# Altium schematic sheet FlexEMG_v0r0_NM.SchDoc
size B
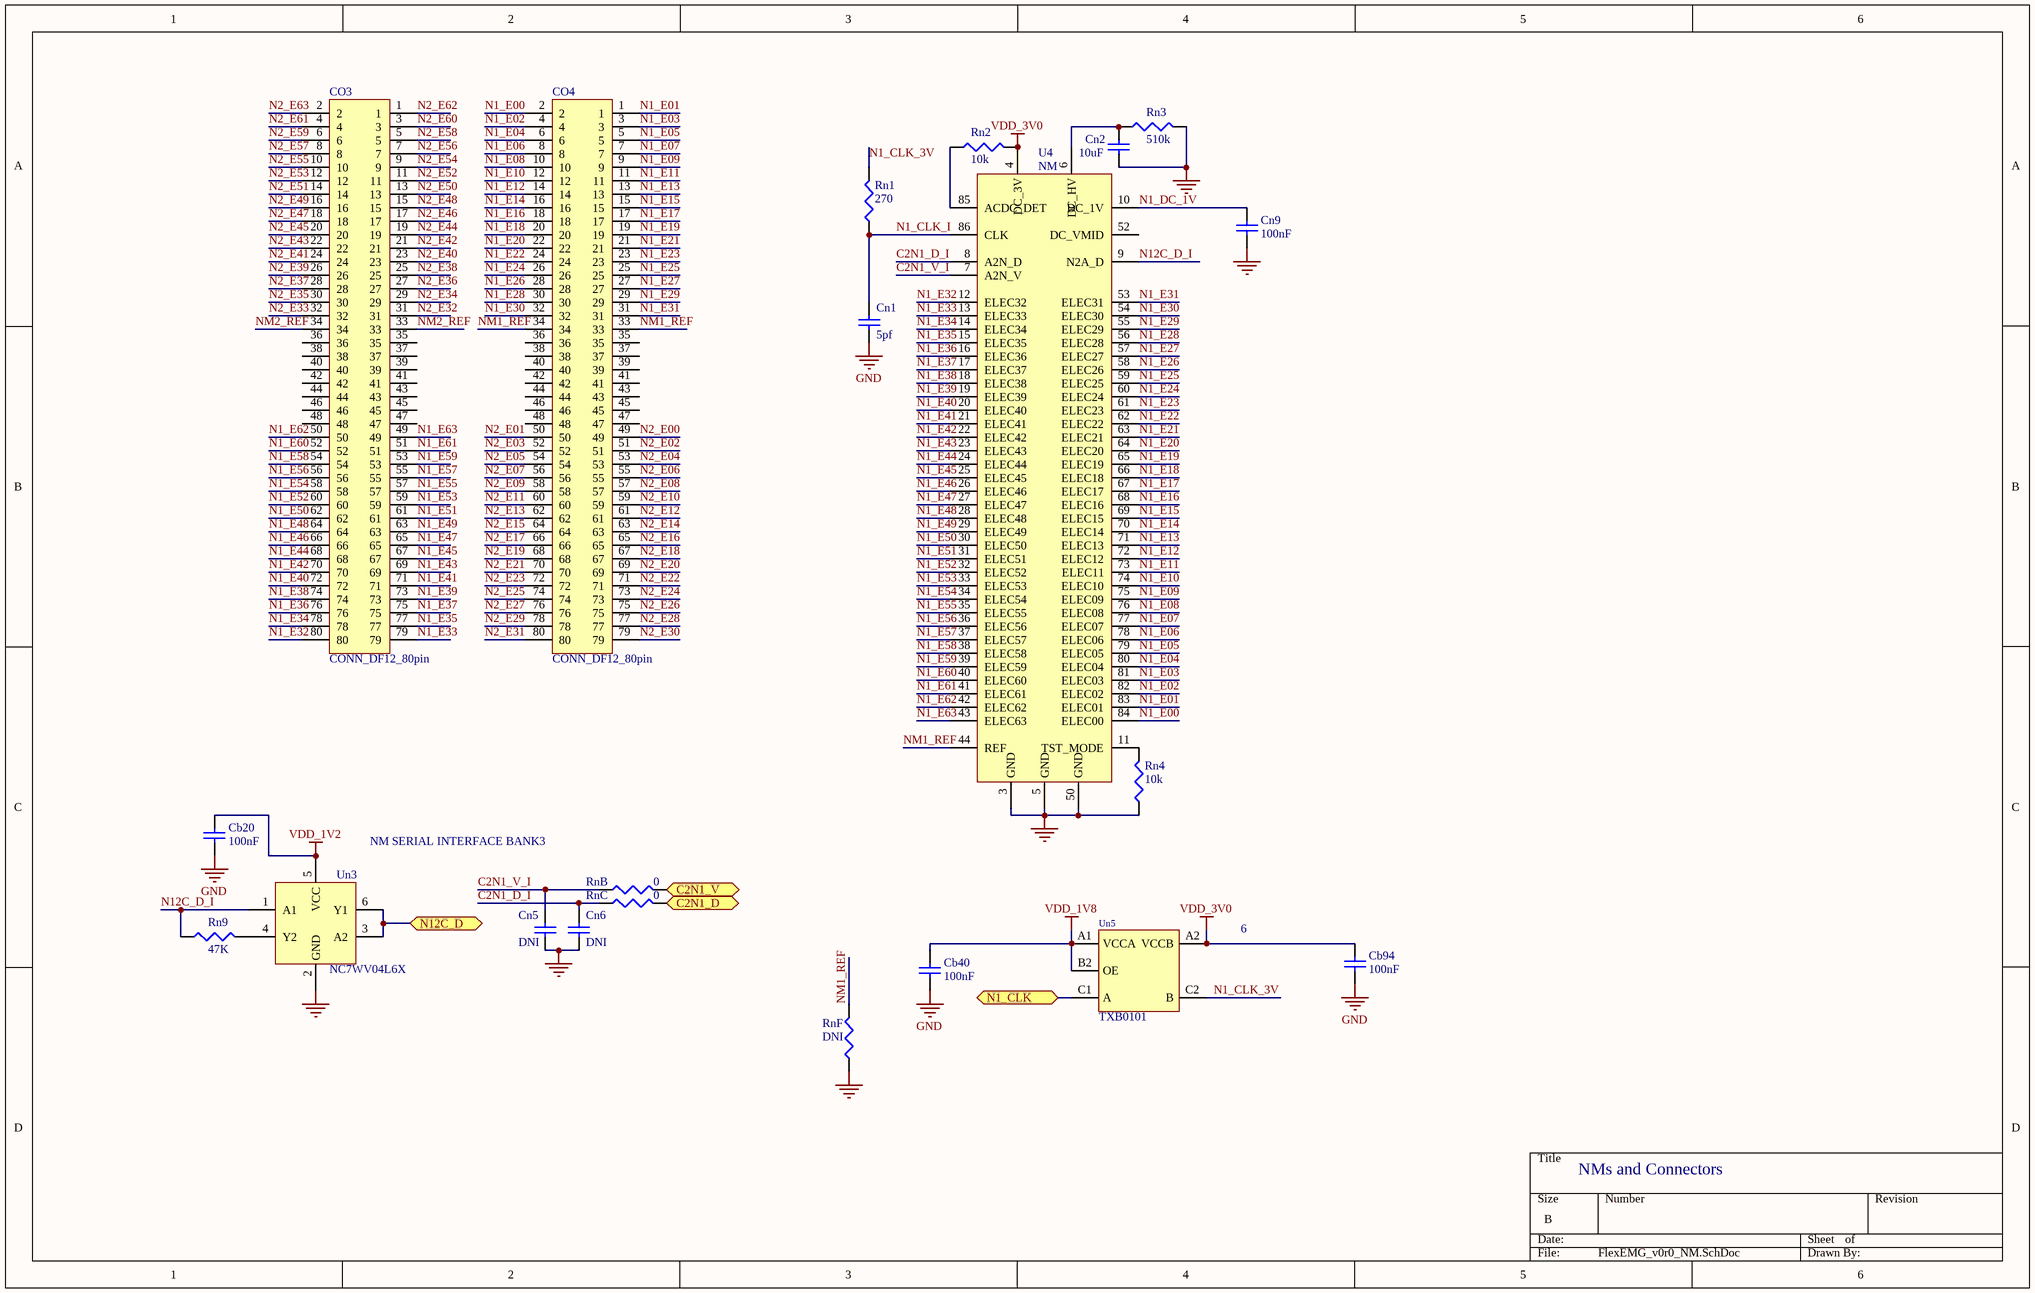
[diagram p0: FlexEMG_v0r0_NM.SchDoc]

## Parts
Cb20  value 100nF  [c0402-Murata-GR]  (hidden comment: GRM155R61H104KE19D)
Cb40  value 100nF  [c0402-Murata-GR]  (hidden comment: GRM155R61H104KE19D)
Cb94  value 100nF  [c0402-Murata-GR]  (hidden comment: GRM155R61H104KE19D)
Cn1  value 5pf  [c0402-Murata-GR]  (hidden comment: GRM1555C1H5R0BA01D)
Cn2  value 10uF  [c0603-Murata-GR]  (hidden comment: GRM188R61E106MA73D)
Cn5  DNI  [c0402-Murata-GR]
Cn6  DNI  [c0402-Murata-GR]
Cn9  value 100nF  [c0402-Murata-GR]  (hidden comment: GRM155R61H104KE19D)
CO3  CONN_DF12_80pin  [CONN_DF12(3.0)-80DP_bottom]
CO4  CONN_DF12_80pin  [CONN_DF12(3.0)-80DP_bottom]
Rn1  value 270  [0402_p]  (hidden comment: ERJ-2RKF2700X)
Rn2  value 10k  [0402_p]  (hidden comment: ERJ-2RKF1002X)
Rn3  value 510k  [0402_p]  (hidden comment: ERJ-2RKF5103X)
Rn4  value 10k  [0402_p]  (hidden comment: ERJ-2RKF1002X)
Rn9  value 47K  [0402_p]  (hidden comment: ERJ-2RKF4702X)
RnB  value 0  [0402_p]  (hidden comment: ERJ-2GE0R00X)
RnC  value 0  [0402_p]  (hidden comment: ERJ-2GE0R00X)
RnF  DNI  [0402_p]
U4  NM  [NMv2]
Un3  NC7WV04L6X  [6micropak]
Un5  TXB0101  [YZP6-ti]

## Ports
C2N1_D (bidir), C2N1_V (bidir), N1_CLK (bidir), N12C_D (bidir)

## Nets
GND: Cb20.1 Cb40.1 Cb94.1 Cn1.1 Cn2.1 Cn5.1 Cn6.1 Cn9.1 Rn3.2 Rn4.1 RnF.1 U4.3(GND) U4.5(GND) U4.50(GND) Un3.2(GND) Un5.B1(GND)
VDD_1V2: Cb20.2 Un3.5(VCC)
VDD_1V8: Cb40.2 Un5.A1(VCCA) Un5.B2(OE)
VDD_3V0: Cb94.2 Rn2.2 U4.4(DC_3V) Un5.A2(VCCB)
C2N1_D: RnC.2 ; port C2N1_D
C2N1_D_I: Cn6.2 RnC.1 U4.8(A2N_D)
C2N1_V: RnB.2 ; port C2N1_V
C2N1_V_I: Cn5.2 RnB.1 U4.7(A2N_V)
N1_CLK: Un5.C1(A) ; port N1_CLK
N1_CLK_3V: Rn1.2 Un5.C2(B)
N1_CLK_I: Cn1.2 Rn1.1 U4.86(CLK)
N1_DC_1V: Cn9.2 U4.10(DC_1V)
N1_E00: CO4.2 U4.84(ELEC00)
N1_E01: CO4.1 U4.83(ELEC01)
N1_E02: CO4.4 U4.82(ELEC02)
N1_E03: CO4.3 U4.81(ELEC03)
N1_E04: CO4.6 U4.80(ELEC04)
N1_E05: CO4.5 U4.79(ELEC05)
N1_E06: CO4.8 U4.78(ELEC06)
N1_E07: CO4.7 U4.77(ELEC07)
N1_E08: CO4.10 U4.76(ELEC08)
N1_E09: CO4.9 U4.75(ELEC09)
N1_E10: CO4.12 U4.74(ELEC10)
N1_E11: CO4.11 U4.73(ELEC11)
N1_E12: CO4.14 U4.72(ELEC12)
N1_E13: CO4.13 U4.71(ELEC13)
N1_E14: CO4.16 U4.70(ELEC14)
N1_E15: CO4.15 U4.69(ELEC15)
N1_E16: CO4.18 U4.68(ELEC16)
N1_E17: CO4.17 U4.67(ELEC17)
N1_E18: CO4.20 U4.66(ELEC18)
N1_E19: CO4.19 U4.65(ELEC19)
N1_E20: CO4.22 U4.64(ELEC20)
N1_E21: CO4.21 U4.63(ELEC21)
N1_E22: CO4.24 U4.62(ELEC22)
N1_E23: CO4.23 U4.61(ELEC23)
N1_E24: CO4.26 U4.60(ELEC24)
N1_E25: CO4.25 U4.59(ELEC25)
N1_E26: CO4.28 U4.58(ELEC26)
N1_E27: CO4.27 U4.57(ELEC27)
N1_E28: CO4.30 U4.56(ELEC28)
N1_E29: CO4.29 U4.55(ELEC29)
N1_E30: CO4.32 U4.54(ELEC30)
N1_E31: CO4.31 U4.53(ELEC31)
N1_E32: CO3.80 U4.12(ELEC32)
N1_E33: CO3.79 U4.13(ELEC33)
N1_E34: CO3.78 U4.14(ELEC34)
N1_E35: CO3.77 U4.15(ELEC35)
N1_E36: CO3.76 U4.16(ELEC36)
N1_E37: CO3.75 U4.17(ELEC37)
N1_E38: CO3.74 U4.18(ELEC38)
N1_E39: CO3.73 U4.19(ELEC39)
N1_E40: CO3.72 U4.20(ELEC40)
N1_E41: CO3.71 U4.21(ELEC41)
N1_E42: CO3.70 U4.22(ELEC42)
N1_E43: CO3.69 U4.23(ELEC43)
N1_E44: CO3.68 U4.24(ELEC44)
N1_E45: CO3.67 U4.25(ELEC45)
N1_E46: CO3.66 U4.26(ELEC46)
N1_E47: CO3.65 U4.27(ELEC47)
N1_E48: CO3.64 U4.28(ELEC48)
N1_E49: CO3.63 U4.29(ELEC49)
N1_E50: CO3.62 U4.30(ELEC50)
N1_E51: CO3.61 U4.31(ELEC51)
N1_E52: CO3.60 U4.32(ELEC52)
N1_E53: CO3.59 U4.33(ELEC53)
N1_E54: CO3.58 U4.34(ELEC54)
N1_E55: CO3.57 U4.35(ELEC55)
N1_E56: CO3.56 U4.36(ELEC56)
N1_E57: CO3.55 U4.37(ELEC57)
N1_E58: CO3.54 U4.38(ELEC58)
N1_E59: CO3.53 U4.39(ELEC59)
N1_E60: CO3.52 U4.40(ELEC60)
N1_E61: CO3.51 U4.41(ELEC61)
N1_E62: CO3.50 U4.42(ELEC62)
N1_E63: CO3.49 U4.43(ELEC63)
N2_E00: CO4.49
N2_E01: CO4.50
N2_E02: CO4.51
N2_E03: CO4.52
N2_E04: CO4.53
N2_E05: CO4.54
N2_E06: CO4.55
N2_E07: CO4.56
N2_E08: CO4.57
N2_E09: CO4.58
N2_E10: CO4.59
N2_E11: CO4.60
N2_E12: CO4.61
N2_E13: CO4.62
N2_E14: CO4.63
N2_E15: CO4.64
N2_E16: CO4.65
N2_E17: CO4.66
N2_E18: CO4.67
N2_E19: CO4.68
N2_E20: CO4.69
N2_E21: CO4.70
N2_E22: CO4.71
N2_E23: CO4.72
N2_E24: CO4.73
N2_E25: CO4.74
N2_E26: CO4.75
N2_E27: CO4.76
N2_E28: CO4.77
N2_E29: CO4.78
N2_E30: CO4.79
N2_E31: CO4.80
N2_E32: CO3.31
N2_E33: CO3.32
N2_E34: CO3.29
N2_E35: CO3.30
N2_E36: CO3.27
N2_E37: CO3.28
N2_E38: CO3.25
N2_E39: CO3.26
N2_E40: CO3.23
N2_E41: CO3.24
N2_E42: CO3.21
N2_E43: CO3.22
N2_E44: CO3.19
N2_E45: CO3.20
N2_E46: CO3.17
N2_E47: CO3.18
N2_E48: CO3.15
N2_E49: CO3.16
N2_E50: CO3.13
N2_E51: CO3.14
N2_E52: CO3.11
N2_E53: CO3.12
N2_E54: CO3.9
N2_E55: CO3.10
N2_E56: CO3.7
N2_E57: CO3.8
N2_E58: CO3.5
N2_E59: CO3.6
N2_E60: CO3.3
N2_E61: CO3.4
N2_E62: CO3.1
N2_E63: CO3.2
N12C_D: Un3.3(A2) Un3.6(Y1) ; port N12C_D
N12C_D_I: Rn9.1 U4.9(N2A_D) Un3.1(A1)
NM1_REF: CO4.33 CO4.34 RnF.2 U4.44(REF)
NM2_REF: CO3.33 CO3.34
NetCn2_2: Cn2.2 Rn3.1 U4.6(DC_HV)
NetRn2_1: Rn2.1 U4.85(ACDC_DET)
NetRn4_2: Rn4.2 U4.11(TST_MODE)
NetRn9_2: Rn9.2 Un3.4(Y2)

Not connected (* = marked no-connect by the designer): CO3 35 36 37 38 39 40 41 42 43 44 45 46 47 48; CO4 35 36 37 38 39 40 41 42 43 44 45 46 47 48; U4 1(AC_PWR+) 2(AC_PWR-) 45(COUNT) 46(PAC) 47(A_TST_HV) 48(A_TST_BG) 49(A_TEST) 51(D_TEST) 52(DC_VMID)

## Notes on the sheet
- (near Un3) NM SERIAL INTERFACE BANK3
- 6
- NMs and Connectors

## Library data of the parts
Cb20 Cb40 Cb94 Cn9 = Cap: CAP CER 0.1UF 50V X5R 0402; Manufacturer: Murata; Supplier: Digikey; Manufacturer PN: GRM155R61H104KE19D; Supplier PN: 490-11917-1-ND
Cn1 = Cap: CAP CER 5PF 50V NP0 0402 +-0.1pf; Manufacturer: Murata; Supplier: Digikey; Manufacturer PN: GRM1555C1H5R0BA01D; Supplier PN: 490-8213-1-ND
Cn2 = Cap: CAP CER 10UF 25V X5R 0603 20%; Manufacturer: Murata; Supplier: Digikey; Manufacturer PN: GRM188R61E106MA73D; Supplier PN: 490-7202-1-ND
Cn5 Cn6 = Cap: Capacitor; Supplier: Digikey; Manufacturer PN: DNI
CO3 CO4 = CONN_DF12_80pin: CONN HEADER 80POS 3MM SMD 0.5MM; Manufacturer PN: DF12(3.0)-80DP-0.5V; Manufacturer: Hirose; Supplier PN: H5225CT-ND; Supplier: Digikey
Rn1 = Resistor: RES SMD 270 OHM 1% 1/10W 0402; Manufacturer: Panasonic; Manufacturer PN: ERJ-2RKF2700X; Supplier: Digikey; Supplier P/N: P270LCT-ND; Power: 1/10W; Package: 0402
Rn2 Rn4 = Resistor: RES SMD 10K OHM 1% 1/10W 0402; Manufacturer: Panasonic; Manufacturer PN: ERJ-2RKF1002X; Supplier: Digikey; Supplier P/N: P10.0KLCT-ND; Power: 1/10W; Package: 0402
Rn3 = Resistor: RES SMD 499K OHM 1% 1/10W 0402; Manufacturer: Panasonic; Manufacturer PN: ERJ-2RKF5103X; Supplier: Digikey; Supplier P/N: P510KLCT-ND; Power: 1/10W; Package: 0402; Note: 1%
Rn9 = Resistor: RES SMD 47K OHM 1% 1/10W 0402; Manufacturer: Panasonic; Manufacturer PN: ERJ-2RKF4702X; Supplier: Digikey; Supplier P/N: P47.0KLCT-ND; Power: 1/10W; Package: 0402
RnB RnC = Resistor: RES SMD 0.0OHM JUMPER 1/10W 0402; Manufacturer: Panasonic; Manufacturer PN: ERJ-2GE0R00X; Supplier: Digikey; Power: 1/10W; Supplier P/N: P0.0JCT-ND; Package: 0402
RnF = Resistor: Manufacturer: Panasonic; Power: 1/10W; Manufacturer PN: DNI; Supplier: Digikey; Package: 0402
U4 = NM: Neuromodulator; Manufacturer: Cortera; Manufacturer PN: Custom
Un3 = Dual Inverter: IC INVERTER ULP-A DUAL 6MICROPAK; Manufacturer: Fairchild; Manufacturer PN: NC7WV04L6X; Supplier: Digikey; Supplier PN: NC7WV04L6XCT-ND
Un5 = TXB0101: Single level converter; Manufacturer PN: TXB0101YZPR; Manufacturer: TI; Supplier PN: 296-21927-1-ND; Supplier: Digikey